# EasyEDA Pro project MFU.eprj, board MAIN_BOARD
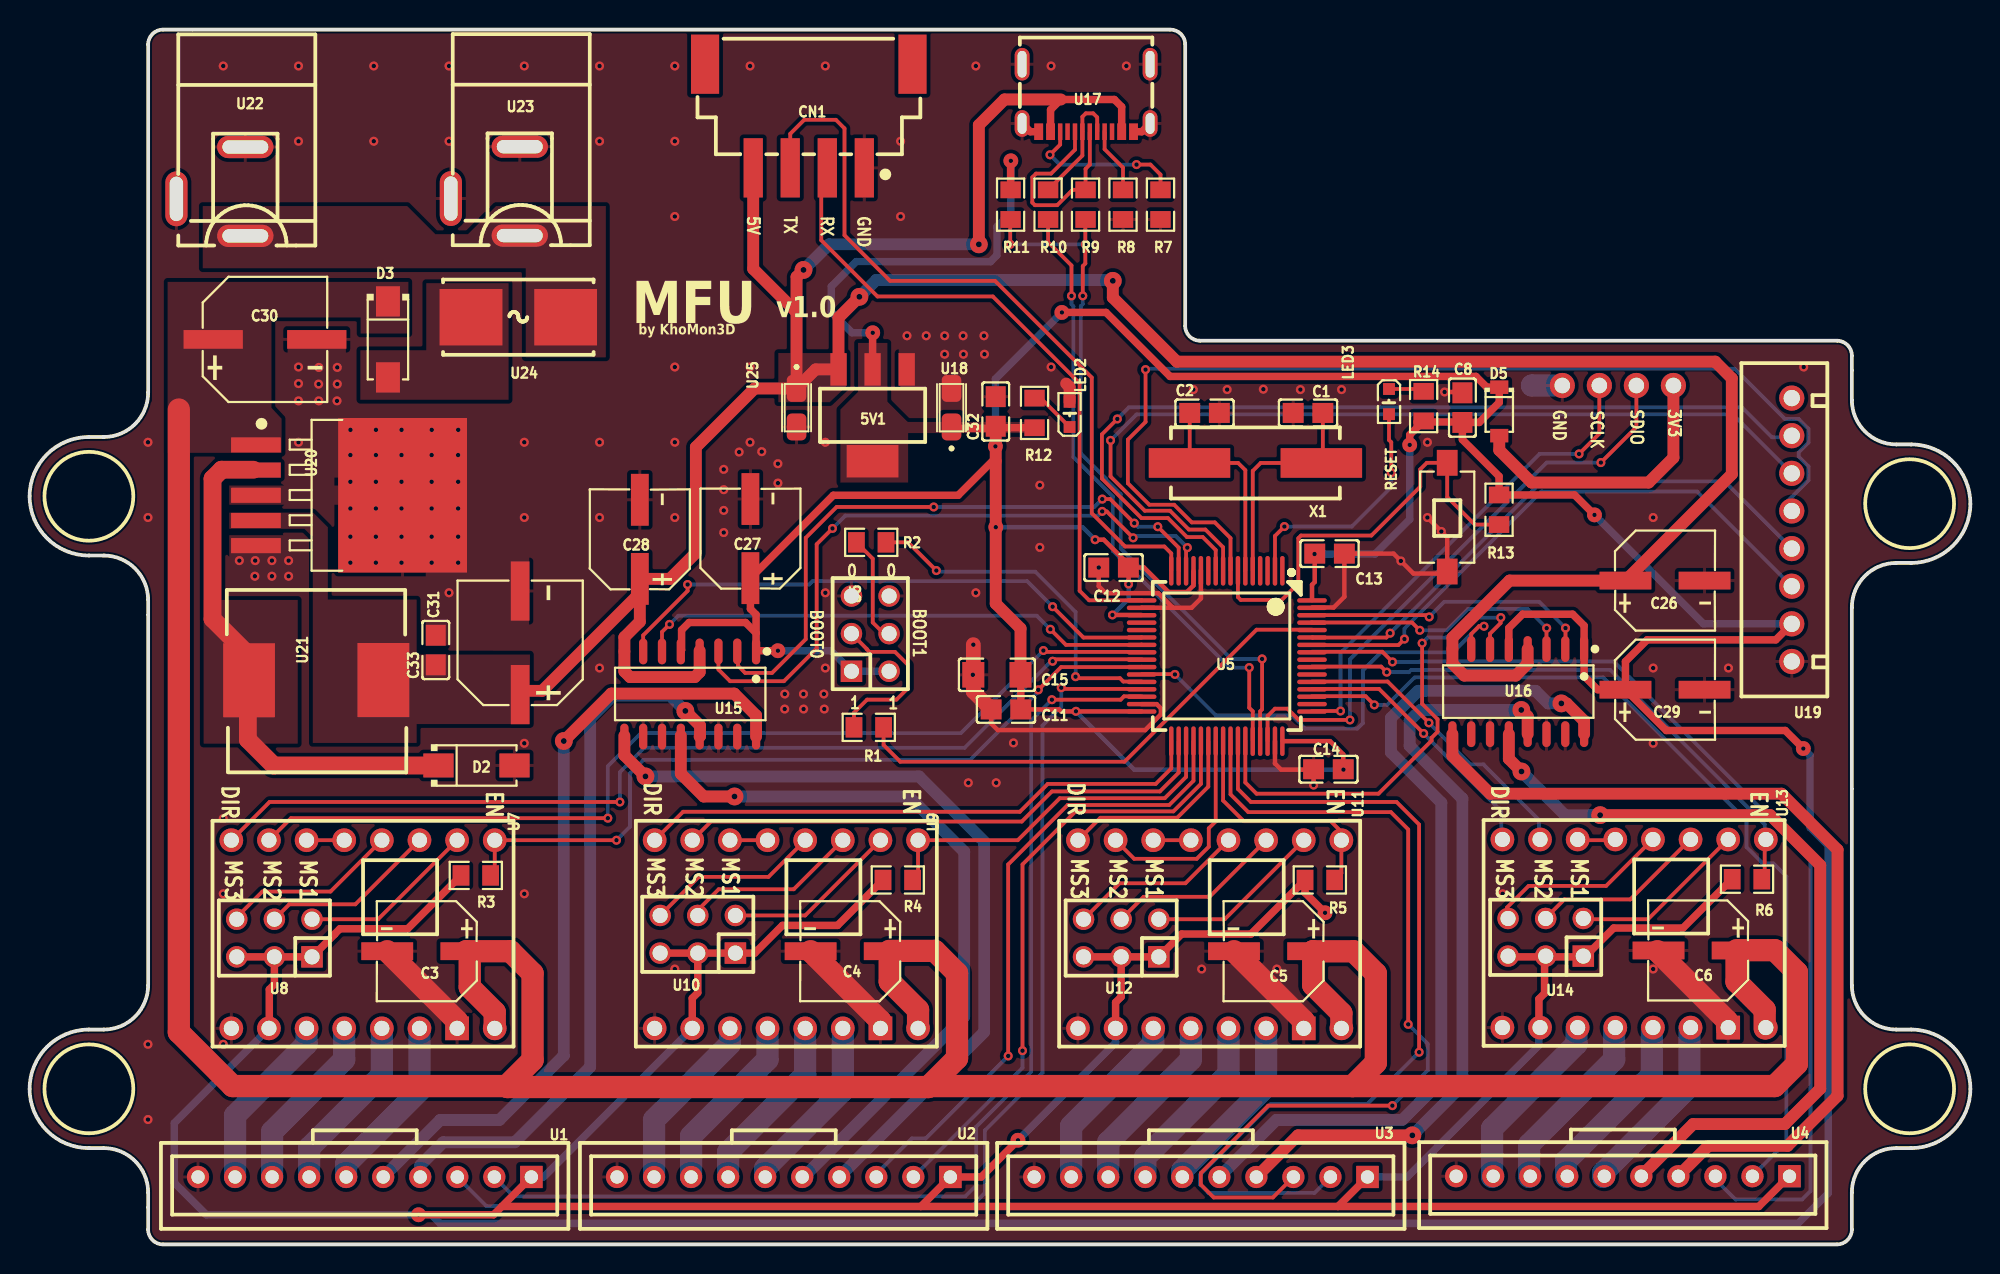
[diagram p3: board, top side]
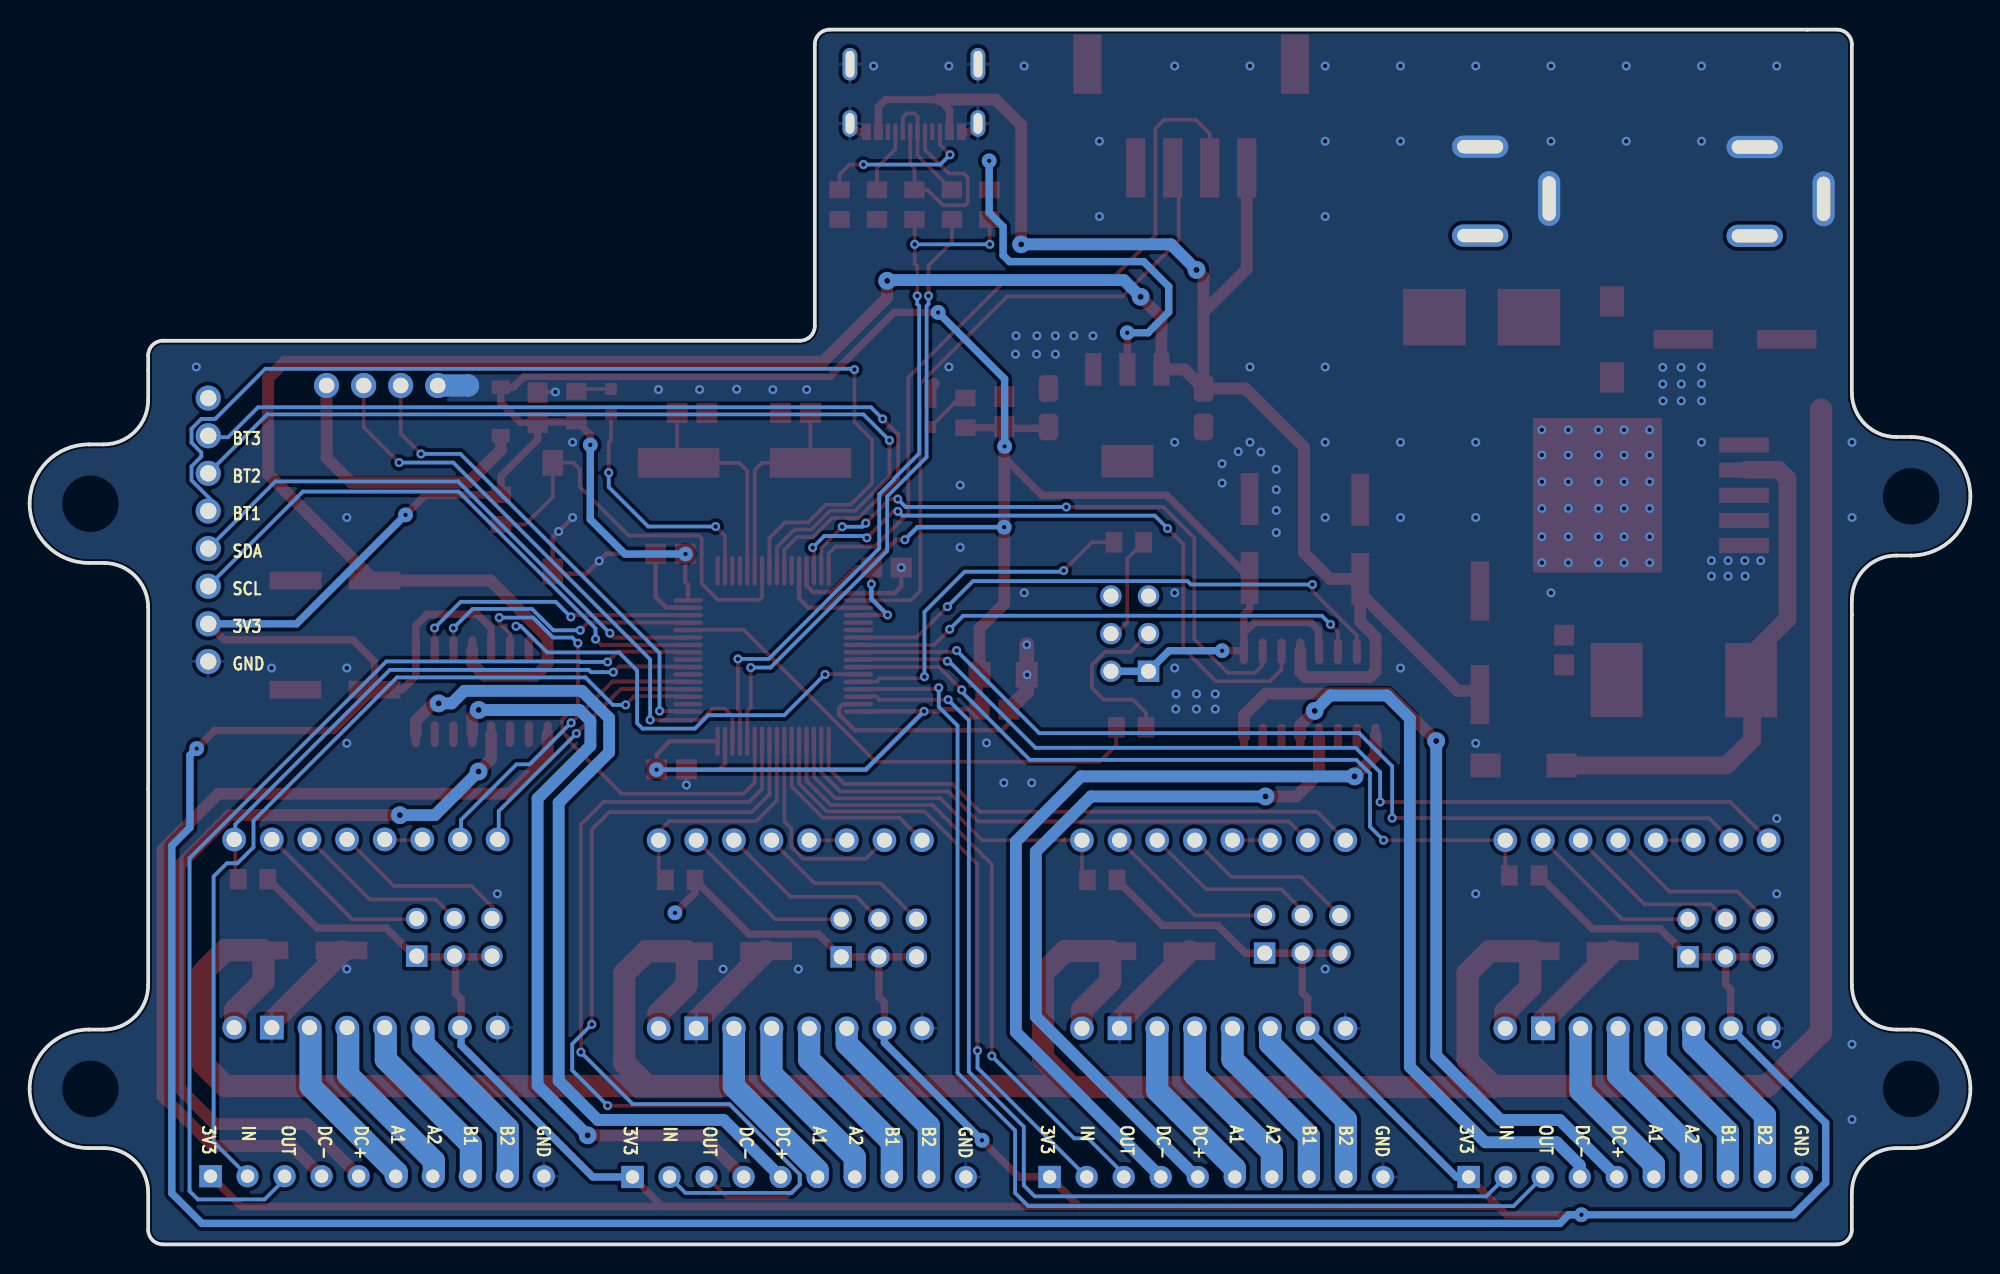
[diagram p4: board, bottom side, seen from below]

Outline 131 x 82 mm; copper layers: Top Layer, Bottom Layer. Coordinates in mm from the lower left corner of the outline.
Outline path: 0,50.5 arc(1.17,53.33) 4,54.5 5,54.5 arc(7.12,55.38) 8,57.5 8,81 arc(8.29,81.71) 9,82 77,82 arc(77.71,81.71) 78,81 78,62 arc(78.29,61.29) 79,61 122,61 arc(122.71,60.71) 123,60 123,57 arc(123.88,54.88) 126,54 127,54 arc(129.83,52.83) 131,50 arc(129.83,47.17) 127,46 126,46 arc(123.88,45.12) 123,43 123,17.5 arc(123.88,15.38) 126,14.5 127,14.5 arc(129.83,13.33) 131,10.5 arc(129.83,7.67) 127,6.5 126,6.5 arc(123.88,5.62) 123,3.5 123,1 arc(122.71,0.29) 122,0 9,0 arc(8.29,0.29) 8,1 8,3.5 arc(7.12,5.62) 5,6.5 4,6.5 arc(1.17,7.67) 0,10.5 arc(1.17,13.33) 4,14.5 5,14.5 arc(7.12,15.38) 8,17.5 8,43.5 arc(7.12,45.62) 5,46.5 4,46.5 arc(1.17,47.67) 0,50.5
Stack: Top Layer 0.035mm / Dielectric1 1.51mm FR4 er 4.5 / Bottom Layer 0.035mm

## Design rules (mm)
template: Custom Config
spacing copperThickness1oz (default): track to track 0.102, other pairs 0.152 to 0.3
spacing copperThickness2oz: track to track 0.203, other pairs 0.152 to 0.3
track width copperThickness1oz: min 0.127, default 0.254, max 2.54
track width copperThickness2oz: min 0.203, default 0.254, max 2.54
track width 12V: min 0.127, default 1.5, max 2.54
track width 5V: min 0.127, default 0.8, max 2.54
track width 3V3: min 0.127, default 0.5, max 2.54
track width 0.3 (default): min 0.127, default 0.254, max 2.54
track width 5v_usb: min 0.127, default 0.5, max 2.54
differential pair differentialPair (default): width min 0.127, default 0.254, max 2.54; gap min 0.152, default 0.152
via viaSize (default): diameter min 0.5, default 0.61, max 10; hole min 0.3, default 0.305, max 6.3
via 12v: diameter min 0.5, default 1.5, max 10; hole min 0.3, default 0.6, max 6.3
via 5v: diameter min 0.5, default 1.2, max 10; hole min 0.3, default 0.4, max 6.3
via 3v3: diameter min 0.5, default 1, max 10; hole min 0.3, default 0.3, max 6.3
net GND uses 12V
net A11 uses 12V
net DC1+ uses 5V, 5v
net DC1- uses 5V, 5v
net 3V3 uses 3V3, 3v3
net A21 uses 12V
net B11 uses 12V
net B21 uses 12V
net A12 uses 12V
net DC2+ uses 5V, 5v
net DC2- uses 5V, 5v
net A22 uses 12V
net B12 uses 12V
net B22 uses 12V
net A13 uses 12V
net DC3+ uses 5V, 5v
net DC3- uses 5V, 5v
net A23 uses 12V
net B13 uses 12V
net B23 uses 12V
net A14 uses 12V
net DC4+ uses 5V, 5v
net DC4- uses 5V, 5v
net A24 uses 12V
net B14 uses 12V
net B24 uses 12V
net 12V uses 12V, 12v
net 5V uses 5V, 5v
net $1N9497 uses 5V
net 12V_IN uses 12V, 12v

## Placement (name value [footprint] x y rotation side)
5V1  -  [SOT-223_L6.7-W3.5-P2.30-BR]  56.9 55.96 90 top
C1  22p  [C0805]  86.29 56.13 180 top
C2  22p  [C0805]  79.31 56.13 0 top
C3  100uF  [CAP-SMD_BD6.3-L6.6-W6.6-FD]  26.81 19.79 180 top
C4  100uF  [CAP-SMD_BD6.3-L6.6-W6.6-FD]  55.39 19.79 180 top
C5  100uF  [CAP-SMD_BD6.3-L6.6-W6.6-FD]  83.97 19.79 180 top
C6  100uF  [CAP-SMD_BD6.3-L6.6-W6.6-FD]  112.62 19.84 180 top
C8  0.1u  [C0805]  96.71 56.48 90 top
C11  0.1u  [C0805]  65.9 36.11 180 top
C12  0.1u  [C0805]  73.17 45.69 180 top
C13  0.1u  [C0805]  87.75 46.63 0 top
C14  0.1u  [C0805]  87.67 32.07 180 top
C15  1u  [C1206]  65.29 38.45 180 top
C26  100u  [CAP-SMD_BD6.3-L6.6-W6.6-FD]  110.39 44.81 0 top
C27  4.7u  [CAP-SMD_BD6.3-L6.6-W6.6-FD]  48.65 47.64 90 top
C28  100u  [CAP-SMD_BD6.3-L6.6-W6.6-FD]  41.19 47.59 90 top
C29  4.7u  [CAP-SMD_BD6.3-L6.6-W6.6-FD]  110.39 37.44 0 top
C30  220uF  [CAP-SMD_BD8.0-L8.3-W8.3-LS10.0-FD-1]  15.89 61.09 0 top
C31  220uF  [CAP-SMD_BD8.0-L8.3-W8.3-LS10.0-FD-1]  33.11 40.61 90 top
C32  0.1u  [C0805]  65.21 56.22 90 top
C33  0.1u  [C0805]  27.42 40.12 90 top
CN1  XH2.54-4P  [CONN-SMD_4P-P2.50-WT]  52.59 76.17 180 top
D2  SS34  [SMA_L4.4-W2.8-LS5.4-RD]  30.16 32.33 0 top
D3  SS54  [SMA_L4.4-W2.8-LS5.4-RD]  24.19 61.09 270 top
D5  BAT54GWJ-HXY  [SOD-123_L2.7-W1.6-LS3.7-RD]  99.2 56.23 270 top
LED2  -  [LED0603-R-RD]  70.2 56.03 90 top
LED3  -  [LED0603-R-RD]  91.76 56.89 270 top
P1  XH2.54-4P  [CONN-TH_4P-P2.50-XH2.54-4P]  107.21 57.98 180 top
R1  10k  [R0805]  56.64 34.9 180 top
R2  10k  [R0805]  56.81 47.39 0 top
R3  10k  [R0805]  30.12 24.9 0 top
R4  10k  [R0805]  58.6 24.6 0 top
R5  10k  [R0805]  87.09 24.6 0 top
R6  10k  [R0805]  115.92 24.65 0 top
R7  5.1k  [R0805]  76.33 70.18 270 top
R8  5.1k  [R0805]  73.8 70.18 270 top
R9  22  [R0805]  71.27 70.18 270 top
R10  22  [R0805]  68.75 70.18 270 top
R11  1.5k  [R0805]  66.22 70.18 270 top
R12  10k  [R0805]  67.83 56.13 270 top
R13  10k  [R0805]  99.19 49.59 90 top
R14  10k  [R0805]  94.1 56.58 270 top
RESET  key_3x6_2P  [SW-SMD_L6.0-W3.5-LS8.0]  95.69 49.09 270 top
U1  BX-HA2.54-10PZZ  [CONN-TH_10P-P2.50_BX-HA2.54-10PZZ]  22.62 4.55 180 top
U2  BX-HA2.54-10PZZ  [CONN-TH_10P-P2.50_BX-HA2.54-10PZZ]  50.9 4.55 180 top
U3  BX-HA2.54-10PZZ  [CONN-TH_10P-P2.50_BX-HA2.54-10PZZ]  79.06 4.55 180 top
U4  BX-HA2.54-10PZZ  [CONN-TH_10P-P2.50_BX-HA2.54-10PZZ]  107.54 4.6 180 top
U5  STM32F103RBT6  [LQFP-64_L10.0-W10.0-P0.50-LS12.0-BL]  80.81 39.72 180 top
U6  HX PZ2.54-3x2P ZZ  [HDR-TH_6P-P2.54-V-M-R3-C2-S2.54_2]  56.74 41.23 0 top
U7  TMC  [DIP-16_L20.3-W15.2-P2.54_LS12.7_A4988]  22.5 20.93 270 top
U8  HX PZ2.54-3x2P ZZ  [HDR-TH_6P-P2.54-V-M-R3-C2-S2.54_2]  16.52 20.68 90 top
U9  TMC  [DIP-16_L20.3-W15.2-P2.54_LS12.7_A4988]  51.08 20.93 270 top
U10  HX PZ2.54-3x2P ZZ  [HDR-TH_6P-P2.54-V-M-R3-C2-S2.54_2]  45.1 20.93 90 top
U11  TMC  [DIP-16_L20.3-W15.2-P2.54_LS12.7_A4988]  79.65 20.93 270 top
U12  HX PZ2.54-3x2P ZZ  [HDR-TH_6P-P2.54-V-M-R3-C2-S2.54_2]  73.68 20.68 90 top
U13  TMC  [DIP-16_L20.3-W15.2-P2.54_LS12.7_A4988]  108.3 20.98 270 top
U14  HX PZ2.54-3x2P ZZ  [HDR-TH_6P-P2.54-V-M-R3-C2-S2.54_2]  102.33 20.73 90 top
U15  MAX1508  [SOP-16_L10.0-W3.9-P1.27-LS6.0-BL]  44.59 37.15 180 top
U16  MAX1508  [SOP-16_L10.0-W3.9-P1.27-LS6.0-BL]  100.48 37.32 180 top
U17  UC.01.51-11-0017,typec  [TYPE-C-SMD_UC.01.51-11-0017]  71.31 77.39 180 top
U18  TAJA106M010RNJ  [CAPMP3216X180N]  62.23 56.48 90 top
U19  XH2.54-8  [CONN-TH_8P-P2.54_XH2.54_C9900012080]  118.94 48.24 270 top
U20  LM2596S-5.0  [TO-263-5_L10.1-W8.7-P1.70-LS14.4-BR]  20.22 50.57 180 top
U21  INDUCTOR/100uH-3A  [IND-SMD_L11.0-W10.2_CXP1050]  19.09 38.37 0 top
U22  POWER-JACK  [DC-IN-TH_POWER-JACK]  12.23 71.08 270 top
U23  POWER-JACK  [DC-IN-TH_POWER-JACK]  30.76 71.1 270 top
U24  1808 SMD Fuseholder  [FUSE-SMD_L9.7-W5.0]  32.99 62.59 180 top
U25  TAJA106M010RNJ  [CAPMP3216X180N]  51.77 56.48 270 top
X1  8MHz  [CRYSTAL-SMD_L11.5-W4.8-LS12.7]  82.74 52.75 0 top

## Footprints (pads in the part's own frame, mm; a bottom-side part is the same pattern mirrored in y, then rotated)
C0805
  rect 1.41x1.35 smd: 1(-1,0) 2(1,0)
C1206
  rect 1.485x1.728 smd: 1(-1.593,0) 2(1.593,0)
CAP-SMD_BD6.3-L6.6-W6.6-FD
  rect 3.5x1.2 smd: 1(-2.67,0) 2(2.67,0)
CAP-SMD_BD8.0-L8.3-W8.3-LS10.0-FD-1
  rect 4x1.26 smd: 1(-3.495,0) 2(3.495,0)
CAPMP3216X180N
  rrect 1.81x1.32 smd: 1(-1.3,0) 2(1.3,0)
CONN-SMD_4P-P2.50-WT
  rect 1.3x4 smd: 1(-3.75,3.5) 2(-1.25,3.5) 3(1.25,3.5) 4(3.751,3.5)
  rect 1.9x4 smd: 5(7,-3.5) 6(-7,-3.5)
CONN-TH_4P-P2.50-XH2.54-4P
  round 1.7 hole 1.05: 1(3.75,0) 2(1.25,0) 3(-1.25,0) 4(-3.75,0)
CONN-TH_8P-P2.54_XH2.54_C9900012080
  round 1.7 hole 1.1: 1(-8.89,0) 2(-6.35,0) 3(-3.81,0) 4(-1.27,0) 5(1.27,0) 6(3.81,0) 7(6.35,0) 8(8.89,0)
CONN-TH_10P-P2.50_BX-HA2.54-10PZZ
  rect 1.524x1.5 hole 0.9: 1(-11.25,0)
  round 1.5 hole 0.9: 2(-8.75,0) 3(-6.25,0) 4(-3.75,0) 5(-1.25,0) 6(1.25,0) 7(3.75,0) 8(6.25,0) 9(8.75,0) 10(11.25,0)
CRYSTAL-SMD_L11.5-W4.8-LS12.7
  rect 5.5x2 smd: 1(-4.45,0) 2(4.45,0)
DC-IN-TH_POWER-JACK
  oval 1.5x3.8 hole 0.9x3.1: 1(2.999,2.325) 2(-2.999,2.325)
  oval 3.7x1.5 hole 3x0.9: 3(0.5,-2.325)
DIP-16_L20.3-W15.2-P2.54_LS12.7_A4988
  round 1.6 hole 1.02: 1(-6.35,8.89) 2(-6.35,6.35) 3(-6.35,3.81) 4(-6.35,1.27) 5(-6.35,-1.27) 6(-6.35,-3.81) 7(-6.35,-6.35) 8(-6.35,-8.89) 9(6.35,-8.89) 10(6.35,-6.35) 11(6.35,-3.81) 12(6.35,-1.27) 13(6.35,1.27) 14(6.35,3.81) 16(6.35,8.89)
  rect 1.6x1.6 hole 1.02: 15(6.35,6.35)
FUSE-SMD_L9.7-W5.0
  rect 4.24x3.81 smd: 1(-3.192,0) 2(3.192,0)
HDR-TH_6P-P2.54-V-M-R3-C2-S2.54_2
  rect 1.45x1.45 hole 1.02: 1(-1.27,-2.54)
  round 1.45 hole 1.02: 2(-1.27,0) 3(-1.27,2.54) 4(1.27,-2.54) 5(1.27,0) 6(1.27,2.54)
IND-SMD_L11.0-W10.2_CXP1050
  custom 3.5x5 smd: 1(-4.28,-0.292) 2(4.788,-0.28)
LED0603-R-RD
  rect 0.8x0.8 smd: 1(0.851,0) 2(-0.851,0)
LQFP-64_L10.0-W10.0-P0.50-LS12.0-BL
  oval 0.3x2 smd: 1(-3.75,-5.75) 2(-3.25,-5.75) 3(-2.75,-5.75) 4(-2.25,-5.75) 5(-1.75,-5.75) 6(-1.25,-5.75) 7(-0.75,-5.75) 8(-0.25,-5.75) 9(0.25,-5.75) 10(0.75,-5.75) 11(1.25,-5.75) 12(1.75,-5.75) 13(2.25,-5.75) 14(2.75,-5.75) 15(3.25,-5.75) 16(3.75,-5.75) 33(3.75,5.75) 34(3.25,5.75) 35(2.75,5.75) 36(2.25,5.75) 37(1.75,5.75) 38(1.25,5.75) 39(0.75,5.75) 40(0.25,5.75) 41(-0.25,5.75) 42(-0.75,5.75) 43(-1.25,5.75) 44(-1.75,5.75) 45(-2.25,5.75) 46(-2.75,5.75) 47(-3.25,5.75) 48(-3.75,5.75)
  oval 2x0.3 smd: 17(5.75,-3.75) 18(5.75,-3.25) 19(5.75,-2.75) 20(5.75,-2.25) 21(5.75,-1.75) 22(5.75,-1.25) 23(5.75,-0.75) 24(5.75,-0.25) 25(5.75,0.25) 26(5.75,0.75) 27(5.75,1.25) 28(5.75,1.75) 29(5.75,2.25) 30(5.75,2.75) 31(5.75,3.25) 32(5.75,3.75) 49(-5.75,3.75) 50(-5.75,3.25) 51(-5.75,2.75) 52(-5.75,2.25) 53(-5.75,1.75) 54(-5.75,1.25) 55(-5.75,0.75) 56(-5.75,0.25) 57(-5.75,-0.25) 58(-5.75,-0.75) 59(-5.75,-1.25) 60(-5.75,-1.75) 61(-5.75,-2.25) 62(-5.75,-2.75) 63(-5.75,-3.25) 64(-5.75,-3.75)
R0805
  rect 1.133x1.377 smd: 1(-1,0) 2(1,0)
SMA_L4.4-W2.8-LS5.4-RD
  rect 2.046x1.62 smd: 1(-2.566,0) 2(2.566,0)
SOD-123_L2.7-W1.6-LS3.7-RD
  rect 0.91x1.22 smd: 1(-1.635,0) 2(1.635,0)
SOP-16_L10.0-W3.9-P1.27-LS6.0-BL
  oval 0.56x1.745 smd: 1(-4.445,-2.873) 2(-3.175,-2.873) 3(-1.905,-2.873) 4(-0.635,-2.873) 5(0.635,-2.873) 6(1.905,-2.873) 7(3.175,-2.873) 8(4.445,-2.873) 9(4.445,2.873) 10(3.175,2.873) 11(1.905,2.873) 12(0.635,2.873) 13(-0.635,2.873) 14(-1.905,2.873) 15(-3.175,2.873) 16(-4.445,2.873)
SOT-223_L6.7-W3.5-P2.30-BR
  rect 2.2x1.1 smd: 1(3.099,-2.3) 2(3.099,0) 3(3.099,2.3)
  rect 2.2x3.5 smd: 4(-3.099,0)
SW-SMD_L6.0-W3.5-LS8.0
  rect 1.74x1.4 smd: 1(-3.67,0) 2(3.67,0)
TO-263-5_L10.1-W8.7-P1.70-LS14.4-BR
  rect 3.358x1.02 smd: 1(4.949,-3.4) 2(4.949,-1.7) 3(4.949,0) 4(4.949,1.7) 5(4.949,3.4)
  rect 8.7x10.431 smd: 6(-4.949,0)
TYPE-C-SMD_UC.01.51-11-0017
  rect 0.6x1.12 smd: A1B12(-3.2,2.277) A4B9(-2.4,2.277) B1A12(3.2,2.277) B4A9(2.4,2.277)
  rect 0.3x1.12 smd: A5(-1.25,2.277) A6(-0.25,2.277) A7(0.25,2.277) A8(1.25,2.277) B5(1.75,2.277) B6(0.75,2.277) B7(-0.75,2.277) B8(-1.75,2.277)
  oval 1x1.8 hole 0.6x1.4: EH1(-4.32,1.722) EH1(4.32,1.722)
  oval 1x2.2 hole 0.6x1.8: EH1(-4.32,-2.277) EH1(4.32,-2.277)

## Nets
As in the schematic, except:
GND: 5V1.1 C1.2 C2.2 C3.2 C4.2 C5.2 C6.2 C8.2 C11.2 C12.2 C13.2 C14.2 C15.2 C26.2 C27.2 C28.2 C29.2 C30.2 C31.2 C32.2 C33.2 CN1.1 D2.2 LED2.1 P1.1 R7.2 R8.2 RESET.2 U1.10 U2.10 U3.10 U4.10 U5.12 U5.18 U5.31 U5.47 U5.63 U6.3 U6.6 U7.9 U7.15 U9.9 U9.15 U11.9 U11.15 U13.9 U13.15 U15.10 U15.11 U15.14 U15.15 U16.10 U16.11 U16.14 U16.15 U17.A1B12 U17.B1A12 U17.EH1 U18.2 U19.8 U20.3 U20.5 U20.6 U22.2 U22.3 U23.2 U23.3 U25.2
RESET: R13.1 RESET.1 U5.7

Pads without a net: CN1 5 6; U5 1 3 4 11 20 21 50 54 56; U17 A8 B8; U19 1

## Via types
v1: diameter 0.61, hole 0.305, Top Layer to Bottom Layer, 202 vias
v2: diameter 1.2, hole 0.4, Top Layer to Bottom Layer, 13 vias
v3: diameter 0.6, hole 0.3, Top Layer to Bottom Layer, 2 vias
v4: diameter 1, hole 0.3, Top Layer to Bottom Layer, 14 vias
v5: diameter 0.61, hole 0.3, Top Layer to Bottom Layer, 2 vias

## Routing (per net, layer and track width the routed paths; a pad name or vN(x,y) marks a point on that pad's centre or on a via; arc(x,y) is an arc through that point)
3V3: length 687.5
  Top Layer w0.3: 75.05,35.98 69.62,35.98 69.48,36.11 C11.1 ; C13.1 86.75,44.71 86.56,44.53 86.56,43.49 ; v5(71.92,47.57) 72.51,47.57 74.17,45.91 C12.1 ; C12.1 74.18,45.67 v3(74.18,44.57) ; C12.1 75.22,45.69 76.87,44.04 78.12,44.04 78.56,44.48 U5.13 ; C14.1 88.67,33.08 87.78,33.97 U5.48 ; 75.05,42.49 v3(73.09,42.49)
  Top Layer w0.5: C14.1 88.67,32.06 v4(88.69,32.05) ; U10.2 U10.3 ; U10.2 U10.1 48.94,19.66 50.81,21.53 54.54,21.53 R4.1 ; U10.2 45.1,16.99 44.73,16.62 U9.10 ; U12.2 U12.1 77.76,20.95 82.44,20.95 R5.1 86.09,23.73 v4(87.44,22.38) ; U12.2 73.68,16.71 73.3,16.34 U11.10 ; U12.2 U12.3 ; C29.1 107.72,39.35 109.18,40.81 117.87,40.81 U19.7 ; C29.1 110.47,34.69 118.5,34.69 v4(119.72,33.47) ; C29.1 105.85,37.44 104.93,38.36 U16.1 104.93,41.76 104.15,42.54 100.78,42.54 99.85,41.61 U16.5 ; R14.2 94.03,55.51 ; 94.03,55.51 93.16,54.64 v4(93.16,53.97) ; 94.03,55.51 93.64,55.51 ; v4(26.25,2) 31.32,2 31.88,2.56 ; U8.2 U8.3 ; U8.2 U8.1 20.59,20.94 20.59,20.95 20.94,21.3 25.52,21.3 R3.1 ; U8.2 16.52,17.55 16.18,17.21 16.18,14.61 U7.10 ; 102.26,19.41 104.98,19.41 106.92,21.35 111.6,21.35 114.85,24.6 ; 102.26,19.41 99.72,19.41 ; 102.26,19.41 102.26,16.94 101.88,16.56 101.88,14.58 ; R12.2 65.17,55.13 65.13,55.09 62.32,55.09 U18.1 ; 31.88,2.56 U1.1 ; 31.88,2.56 60.16,2.56 ; C8.1 97.84,55.48 99.2,56.84 D5.1 98.35,57.86 97.63,58.59 76.98,58.59 72.66,62.91 v4(69.68,62.91) ; C8.1 96.71,54.32 99.19,51.85 R13.2 104.28,50.59 v4(105.63,49.24) ; C8.1 96.33,55.48 96.3,55.51 94.1,55.51 ; v4(56.91,61.54) 56.9,61.53 5V1.2 ; C15.1 66.9,38.43 C11.1 ; U3.1 88.31,2.56 ; 88.31,2.56 116.72,2.56 118.71,4.55 ; 88.31,2.56 60.16,2.56 ; 43.96,40.08 44.01,40.13 44.01,41.47 44.51,41.98 48.32,41.98 49.04,41.27 ; v4(50.51,40.07) 49.08,40.07 U15.1 ; 49.04,41.27 49.04,42.51 48.65,42.89 C27.1 54.25,50.56 62.68,50.56 65.09,52.98 65.21,52.86 ; 49.04,41.27 49.04,40.08 ; R11.1 66.22,73.13 v4(66.23,73.15) ; 60.16,2.56 U2.1 64.23,4.55 v4(66.71,7.03)
  Top Layer w0.8: C32.1 65.21,43.25 66.88,41.58 C15.1
  Bottom Layer w0.3: v5(70.63,35.98) 74.56,32.05 v4(88.69,32.05) ; v5(71.92,47.57) 71.07,48.41 v4(65.22,48.41) ; v3(73.09,42.49) 74.18,43.58 v3(74.18,44.57)
  Bottom Layer w0.5: 101.88,14.58 101.88,13.44 92.99,4.55 U3.1 ; U9.10 34.7,4.55 U1.1 ; v4(119.72,33.47) 120.18,33.01 120.18,28.14 121.4,26.92 121.4,3.45 119.37,1.42 27.7,1.42 27.12,2 v4(26.25,2) 11.93,2 9.77,4.16 9.77,8.2 U7.10 ; v4(93.16,53.97) 93.16,48.94 90.82,46.6 v4(86.73,46.6) ; v4(69.68,62.91) 65.19,58.42 v4(65.19,53.87) ; U11.10 73.3,13.62 v4(66.71,7.03) ; U6.4 U6.1 54.09,40.07 v4(50.51,40.07) ; v4(56.91,61.54) 55.51,61.54 54.12,62.93 54.12,64.66 55.79,66.34 64.86,66.34 65.29,66.77 65.29,68.7 66.23,69.64 v4(66.23,73.15) ; U19.7 112.98,41.89 v4(105.63,49.24)
5V: length 209
  Top Layer w0.5: U17.A4B9 73.71,76.79 73.22,77.29 69.61,77.29 68.91,76.59 U17.B4A9
  Top Layer w0.8: 51.77,62.92 U25.1 ; 51.77,62.92 51.77,65.31 v2(52.24,65.78) ; 51.77,62.92 48.84,65.85 48.84,72.67 ; U25.1 53.05,59.06 5V1.3 54.6,62.56 v2(56.01,63.96) ; U25.1 48.93,57.78 44.97,53.82 44.97,46.68 43.22,44.92 C28.1 41.19,43.96 ; 45.23,40.08 45.23,38.63 44.9,38.3 40.53,38.3 40.15,38.68 U15.8 40.15,40.99 41.19,42.03 41.19,43.96 ; 41.19,43.96 34.6,37.37 33.29,37.37 33.08,37.16 ; v2(73.12,65.04) 73.12,63.91 77.44,59.59 113.77,59.59 114.9,58.46 114.9,51.99 C26.1 99.9,44.81 96.04,40.95 U16.8 96.04,39.2 96.84,38.4 100.32,38.4 101.12,39.2 101.12,40.19 ; v2(64.07,67.51) 64.07,75.56 65.8,77.29 69.61,77.29
  Bottom Layer w0.8: v2(64.07,67.51) 53.96,67.51 v2(52.24,65.78) ; v2(56.01,63.96) 57.14,65.09 73.06,65.09 v2(73.12,65.04)
12V: length 228.4
  Top Layer w1.5: 10.07,56.36 10.07,14.32 13.7,10.69 32.2,10.69 ; 32.2,10.69 32.26,10.62 60.66,10.62 60.72,10.69 ; 32.2,10.69 33.95,12.44 33.95,18.29 32.45,19.79 C3.1 29.71,19.56 29.71,17.37 31.39,15.68 U7.16 ; 58.03,19.81 61.1,19.81 62.6,18.31 62.6,12.56 60.72,10.69 ; C5.1 86.64,19.78 ; 86.64,19.78 89.37,19.78 90.87,18.28 90.87,12.26 89.3,10.69 ; 86.64,19.78 86.64,17.51 88.54,15.6 U11.16 ; 117.12,14.58 117.12,15.83 115.21,17.74 115.21,19.79 ; 89.3,10.69 60.72,10.69 ; 89.3,10.69 117.79,10.69 119.29,12.19 119.29,18.36 117.79,19.86 115.23,19.86 ; U9.16 59.97,15.83 58.06,17.74 C4.1
GND: length 91.2
  Top Layer w0.3: 86.56,42.99 88.02,42.99 88.75,43.72 C13.2 92.06,46.63 v1(92.56,46.13) 93.41,45.28 95.55,45.28 RESET.2 95.69,47.73 v1(95.29,48.13) v1(94.35,49.07) ; 77.12,42.99 77.15,42.97 78.42,42.97 79.06,43.61 79.06,45.49 ; 77.12,42.99 77.12,43.03 76.19,43.96 72.63,43.96 72.17,44.43 v1(72.17,45.69) ; 77.12,42.99 77.1,42.97 75.07,42.97 75.06,42.97 ; 75.06,36.47 76.08,36.47 76.36,36.18 76.36,35.78 75.3,34.71 65.35,34.71 64.9,35.16 C11.2 ; C8.2 96.66,57.54 v1(95.51,57.54) ; v1(86.67,31.01) C14.2 86.64,32.05 84.47,32.05 84.06,32.46 U5.47
  Top Layer w0.5: U17.EH1 75.08,75.11 U17.A1B12 ; U17.B1A12 67.55,75.11 U17.EH1
  Top Layer w0.8: 70.2,56.88 70.2,57.88 69.97,58.11
  Top Layer w1: v1(63.7,40.48) C15.2 63.7,37.32 C11.2
  Top Layer w1.5: C3.2 28.85,15.07 U7.15 ; 114.58,14.58 114.58,15.09 109.87,19.79 ; C5.2 86,15.08 U11.15 ; C4.2 57.43,15.08 U9.15
  Bottom Layer w1.5: 101.41,57.98 101.41,57.98 P1.1
  vias: v1(7.99,54.15) v1(7.99,49.07) v1(7.99,13.51) v1(7.99,8.43) v1(13.07,79.55) v1(13.07,28.75) v1(13.07,23.67) v1(13.07,13.51) v1(14.16,46.16) v1(15.22,46.16) v1(15.2,45.1) v1(16.35,46.16) v1(16.35,45.1) v1(17.48,46.16) v1(17.48,45.1) v1(18.15,79.55) v1(18.15,74.47) v1(18.15,59.23) v1(18.15,58.11) v1(18.15,56.94) v1(18.15,54.15) v1(19.53,59.2) v1(19.51,58.07) v1(19.52,56.94) v1(20.77,59.2) v1(20.77,58.07) v1(20.75,56.94) v1(21.65,54.98) v1(21.65,53.28) v1(21.65,51.48) v1(21.65,49.68) v1(21.65,47.77) v1(21.65,46.02) v1(23.23,79.55) v1(23.23,74.47) v1(23.38,54.98) v1(23.37,53.28) v1(23.37,51.48) v1(23.37,49.68) v1(23.37,47.77) v1(23.37,46.02) v1(25.11,54.98) v1(25.1,53.28) v1(25.1,51.48) v1(25.1,49.68) v1(25.1,47.77) v1(25.1,46.02) v1(27.14,54.98) v1(27.14,53.28) v1(27.14,51.48) v1(27.14,49.68) v1(27.14,47.77) v1(27.14,46.02) v1(28.31,79.55) v1(28.31,74.47) v1(28.31,43.99) v1(28.93,54.98) v1(28.92,53.28) v1(28.92,51.48) v1(28.92,49.68) v1(28.92,47.77) v1(28.92,46.02) v1(33.39,79.55) v1(33.39,54.15) v1(33.39,49.07) v1(33.39,33.83) v1(33.39,23.67) v1(38.47,79.55) v1(38.47,74.47) v1(38.47,54.15) v1(38.47,49.07) v1(38.47,38.91) v1(43.55,79.55) v1(43.55,74.47) v1(43.55,69.39) v1(43.55,59.23) v1(43.55,54.15) v1(43.55,49.07) v1(43.55,18.59) v1(46.85,52.32) v1(46.85,50.94) v1(46.85,49.54) v1(46.85,48.05) v1(47.89,53.49) v1(48.63,79.55) v1(48.63,59.23) v1(48.63,54.15) v1(49.42,53.51) v1(50.51,52.7) v1(50.51,51.39) v1(50.97,37.15) v1(50.97,36.14) v1(52.23,37.15) v1(52.24,36.14) v1(53.61,37.15) v1(53.71,79.55) v1(53.71,54.15) v1(53.71,43.99) v1(53.71,38.91) v1(53.64,36.14) v1(58.79,74.47) v1(58.79,69.39) v1(59.22,61.33) v1(60.52,61.33) v1(61.76,61.33) v1(61.76,60.09) v1(63.01,61.33) v1(63.03,60.09) v1(63.36,31.16) v1(63.67,38.45) v1(63.87,79.55) v1(63.87,43.99) v1(64.42,61.33) v1(64.45,60.09) v1(65.24,31.16) v1(66.41,33.85) v1(68.19,51.25) v1(68.19,47.05) v1(68.95,79.55) v1(68.95,59.23) v1(74.03,79.55) v1(78.55,57.7) v1(79.11,18.59) v1(80.83,57.7) v1(83.28,57.73) v1(84.19,18.59) v1(85.78,57.7) v1(88.56,57.7) v1(94.35,54.15) v1(99.43,23.67) v1(109.59,49.07) v1(109.59,38.91) v1(109.59,33.83) v1(109.59,18.59) v1(114.67,38.91) v1(119.75,59.23)
A11: length 12.1
  Bottom Layer w1.5: U7.14 26.31,10.37 21.37,5.42 U1.6
A12: length 12.2
  Bottom Layer w1.5: U9.14 54.89,10.37 49.65,5.13 U2.6
A13: length 12.4
  Bottom Layer w1.5: U3.6 77.81,5 83.46,10.66 U11.14
A14: length 12.4
  Bottom Layer w1.5: 106.21,4.55 106.21,4.85 112.04,10.67 112.04,14.58
A21: length 12.1
  Bottom Layer w1.5: U7.13 23.77,11.42 18.87,6.52 U1.7
A22: length 12.2
  Bottom Layer w1.5: U9.13 52.35,11.42 47.15,6.23 U2.7
A23: length 12.4
  Bottom Layer w1.5: U3.7 75.31,5.89 80.92,11.51 U11.13
A24: length 12.4
  Bottom Layer w1.5: 109.5,14.58 109.5,11.42 103.71,5.64 103.71,4.55
B11: length 12
  Bottom Layer w1.5: U1.8 16.37,7.61 21.23,12.48 U7.12
B12: length 12.2
  Bottom Layer w1.5: U2.8 44.65,7.32 49.81,12.48 U9.12
B13: length 12.3
  Bottom Layer w1.5: U3.8 72.81,6.9 78.38,12.48 U11.12
B14: length 12.4
  Bottom Layer w1.5: 101.21,4.55 101.21,6.73 106.96,12.48 106.96,14.58
B21: length 12
  Bottom Layer w1.5: U7.11 18.69,13.53 13.87,8.7 U1.9
B22: length 12.2
  Bottom Layer w1.5: U9.11 47.27,13.53 42.15,8.41 U2.9
B23: length 12.3
  Bottom Layer w1.5: U11.11 75.84,13.53 70.31,7.99 U3.9
B24: length 12.4
  Bottom Layer w1.5: 104.42,14.58 104.42,13.53 98.71,7.83 98.71,4.55
BOOT0: length 34.3
  Top Layer w0.254: R1.1 57.64,33.71 58.77,32.58 73.9,32.58 82.81,41.49 86.56,41.49
BOOT1: length 23.7
  Top Layer w0.254: R2.2 59.3,47.39 v1(61.2,45.48) ; v1(70.6,38.32) 70.7,38.22 73.6,38.22 73.82,37.99 75.06,37.99
  Bottom Layer w0.254: v1(61.2,45.48) 61.28,45.41 67.88,45.41 70.6,42.69 v1(70.6,38.32)
BT_DOWN: length 62.2
  Top Layer w0.254: v1(73.42,55.72) 72.38,54.68 72.38,51.7 75.05,49.03 76.84,49.03 78.12,47.75 79.19,47.75 80.06,46.87 80.06,45.49
  Bottom Layer w0.254: U19.2 118.84,54.49 117.61,54.49 115.58,56.51 74.21,56.51 v1(73.42,55.72)
BT_ENTER: length 61.9
  Top Layer w0.254: 80.56,45.49 80.56,47.06 79.36,48.25 78.25,48.25 76.98,49.52 75.27,49.52 72.96,51.83 v1(72.96,54.27)
  Bottom Layer w0.254: U19.3 114.97,56.03 74.71,56.03 v1(72.96,54.27)
BT_UP: length 72.2
  Top Layer w0.254: 81.06,45.49 81.06,47.67 80,48.74 78.45,48.74 77.25,49.93 75.58,49.93 74.13,51.38 74.13,54.32 75.32,55.52 v1(75.32,59.05)
  Bottom Layer w0.254: v1(75.32,59.05) 75.38,59.11 115.09,59.11 118.48,55.72 119.41,55.72 120.07,55.06 120.07,54.12 119.41,53.46 119.41,53.18 120.07,52.52 120.07,51.58 118.51,50.02 118.51,49.94 U19.4
D+: length 48.4
  Top Layer w0.254: R11.2 66.19,69.16 v1(66.19,67.51) ; v1(71.09,64.03) 71.09,66.04 71.26,66.21 v1(71.26,67.51) 71.26,69.17 R9.2 ; 83.06,33.99 83.06,35.98 83.19,36.12 v1(83.19,39.52)
  Bottom Layer w0.254: v1(83.19,39.52) 81.11,39.52 73.65,46.98 73.65,50.64 72.66,51.63 72.66,51.68 70.96,53.38 70.96,63.34 71.09,63.47 v1(71.09,64.03) ; v1(66.19,67.51) v1(71.26,67.51)
D-: length 41.7
  Top Layer w0.254: R10.2 68.75,67.66 70.32,66.08 v1(70.32,64.03) ; 82.56,33.99 82.56,35.98 82.32,36.22 v1(82.32,38.94)
  Bottom Layer w0.254: v1(82.32,38.94) 80.99,38.94 73.12,46.81 73.12,50.49 70.46,53.15 70.46,63.34 70.32,63.47 v1(70.32,64.03)
DC1+: length 53.2
  Top Layer w0.8: U15.16 49.04,35.71 47.56,37.18 39.26,37.18 v2(36.06,33.98)
  Bottom Layer w0.8: U1.5 27.72,8.4 31.71,8.4 36.06,12.74 v2(36.06,33.98)
DC1-: length 48.2
  Top Layer w0.8: v2(44.26,36.01) 45.25,35.02 45.25,34.31 U15.13
  Bottom Layer w0.8: v2(44.26,36.01) 43.22,37.05 39.38,37.05 37.83,35.5 37.83,11.98 32.75,6.89 27.92,6.89 26.37,5.34 U1.4
DC2+: length 50.4
  Top Layer w0.8: v2(47.58,30.23) 45.5,30.23 43.96,31.78 43.96,34.33
  Bottom Layer w0.8: U2.5 52.25,4.55 63.08,15.38 63.08,26.51 59.36,30.23 v2(47.58,30.23)
DC2-: length 54.7
  Top Layer w0.8: v2(41.57,31.59) 40.15,33.01 40.15,34.33
  Bottom Layer w0.8: U2.4 64.43,14.33 64.43,27.2 60.03,31.59 v2(41.57,31.59)
DC3+: length 59.1
  Top Layer w0.8: U16.16 104.93,35.34 103.75,36.52 v2(103.39,36.52)
  Bottom Layer w0.8: U3.5 84.16,8.4 92.65,8.4 95.29,11.04 95.29,29.81 91.89,33.22 91.89,35.53 93.72,37.37 101.66,37.37 102.5,36.52 v2(103.39,36.52)
DC3-: length 52.2
  Top Layer w0.8: v2(93.33,7.36) 85.61,7.36 U3.4 ; v2(100.69,36.07) 101.12,35.64 101.12,34.44
  Bottom Layer w0.8: v2(100.69,36.07) 93.88,36.07 93.15,35.34 93.15,33.66 96.71,30.09 96.71,10.74 v2(93.33,7.36)
DC4+: length 55.4
  Top Layer w0.8: v2(106.01,28.97) 117.49,28.97 120.87,25.6 120.87,10.51 118.48,8.12 112.29,8.12 108.71,4.55 ; v2(100.7,31.92) 99.85,32.77 U16.12
  Bottom Layer w0.8: v2(106.01,28.97) 103.65,28.97 v2(100.7,31.92)
DC4-: length 59.8
  Top Layer w0.8: 111.21,4.55 113.31,6.65 118.66,6.65 122.04,10.03 122.04,26.64 118.25,30.42 98.59,30.42 96.04,32.98 U16.9
DIR1: length 67.7
  Top Layer w0.254: 75.06,39.49 69.18,39.49 v1(69.05,39.36) ; v1(39.84,29.86) 16.2,29.86 U7.8
  Bottom Layer w0.254: v1(39.84,29.86) 39.84,31.87 41.49,33.52 63.11,33.52 68.95,39.36 v1(69.05,39.36)
DIR2: length 38.7
  Top Layer w0.254: U9.8 44.11,29.2 66.84,29.2 68.72,31.08 76.01,31.08 77.06,32.13 77.06,33.99
DIR3: length 13.4
  Top Layer w0.254: U11.8 72.28,28.8 77.46,28.8 79.56,30.9 79.56,33.99
DIR4: length 18.2
  Top Layer w0.254: 86.56,37.49 91.09,37.49 v1(94.1,34.49)
  Bottom Layer w0.254: v1(94.1,34.49) 99.34,29.25 99.34,27.28
EN1: length 53.2
  Top Layer w0.254: v1(68.09,37.43) 69.62,38.97 75.04,38.97 75.06,38.99 ; R3.2 31.39,25.18 U7.1 v1(39.61,27.28)
  Bottom Layer w0.254: v1(68.09,37.43) 68.09,37.31 63.49,32.71 41.44,32.71 40.53,31.79 40.53,28.2 v1(39.61,27.28)
EN2: length 25.1
  Top Layer w0.254: R4.2 59.97,24.97 U9.1 66.7,27.28 69.53,30.12 76.62,30.12 78.06,31.56 78.06,33.99
EN3: length 16.3
  Top Layer w0.254: 80.56,33.99 80.56,29.96 81.95,28.57 87.82,28.57 88.54,27.85 U11.1 88.54,25.05 R5.2
EN4: length 39
  Top Layer w0.254: 86.55,39 91.23,39 v1(91.61,38.63) ; 117.12,27.28 117.12,24.87 116.85,24.6
  Bottom Layer w0.254: 117.12,27.28 117.12,28.35 106.69,38.78 93.26,38.78 93.1,38.63 v1(91.61,38.63)
INA1: length 42.8
  Top Layer w0.254: v1(72.4,50.31) 72.94,50.31 v1(74.56,48.68) ; v1(76.15,48.44) 77.56,47.03 77.56,45.49 ; v1(61.02,49.78) 54.47,49.78 52.39,47.69 52.39,40.85 50.11,38.58 48.3,38.58 47.82,39.06 47.82,40.03 47.77,40.08
  Bottom Layer w0.254: v1(72.4,50.31) 71.87,49.78 v1(61.02,49.78) ; v1(76.15,48.44) 74.8,48.44 v1(74.56,48.68)
INA2: length 34.9
  Top Layer w0.254: 75.06,40.49 75.04,40.47 69.95,40.47 v1(68.9,41.52) ; 42.69,40.08 42.69,41.34 v1(43.19,41.85)
  Bottom Layer w0.254: v1(43.19,41.85) 43.78,42.44 67.98,42.44 v1(68.9,41.52)
INA3: length 19.8
  Top Layer w0.254: v1(94.47,42.35) 94.35,42.48 86.55,42.48 ; U16.2 103.67,40.2 v1(103.67,41.6)
  Bottom Layer w0.254: v1(94.47,42.35) 95.49,43.38 101.9,43.38 v1(103.67,41.6)
INA4: length 32.8
  Top Layer w0.254: v1(99.3,42.31) 99.29,42.3 99.29,41.94 98.58,41.23 U16.6 ; v1(93.99,40.58) 93.99,36.49 95.03,35.45 95.03,34.6 94.63,34.19 94.63,34 91.05,30.42 82.82,30.42 82.06,31.18 82.06,33.99
  Bottom Layer w0.254: v1(93.99,40.58) 94.38,40.96 95.67,40.96 97.01,42.31 v1(99.3,42.31)
INB1: length 44.8
  Top Layer w0.254: 78.06,45.49 78.06,46.95 v1(78.14,47.03) ; v1(54.19,48.33) 53.12,47.26 53.12,40.23 50.91,38.02 47.28,38.02 46.5,38.8 U15.3 ; v1(74.49,47.69) 72.7,49.48 v1(72.4,49.48)
  Bottom Layer w0.254: v1(54.19,48.33) 55.06,49.19 72.11,49.19 v1(72.4,49.48) ; v1(78.14,47.03) 77.36,47.82 74.61,47.82 v1(74.49,47.69)
INB2: length 38
  Top Layer w0.254: v1(44.41,44.54) 44.41,44.11 41.42,41.12 41.42,40.08 ; 75.06,40.99 75.03,40.96 71.13,40.96 v1(69.05,43.05)
  Bottom Layer w0.254: v1(44.41,44.54) 52.62,44.54 52.84,44.77 67.33,44.77 v1(69.05,43.05)
INB3: length 18.6
  Top Layer w0.254: v1(93.84,41.45) 93.31,41.98 86.57,41.98 86.55,42 ; U16.3 102.39,41.58 v1(102.4,41.6)
  Bottom Layer w0.254: v1(93.84,41.45) 95.65,41.45 97.09,42.89 101.11,42.89 v1(102.4,41.6)
INB4: length 31.7
  Top Layer w0.254: v1(98.17,41.73) 97.83,41.73 97.31,41.2 U16.7 ; 75.06,38.49 77.29,38.49 v1(77.31,38.47)
  Bottom Layer w0.254: v1(98.17,41.73) 98.16,41.74 97.84,41.74 96.06,39.96 91.21,39.96 89.99,38.74 89.99,35.18 89.62,34.82 86.09,34.82 85.19,35.72 80.06,35.72 v1(77.31,38.47)
LED: length 16.5
  Top Layer w0.254: v1(84.7,48.46) 84.06,47.82 84.06,45.49 ; v1(91.91,52.09) 91.91,54.15 91.76,54.3 LED3.1
  Bottom Layer w0.254: v1(91.91,52.09) 91.91,51.12 89.24,48.46 v1(84.7,48.46)
RESET: length 28.9
  Top Layer w0.254: U5.7 81.56,43.69 81.75,43.5 84.52,43.5 85.64,44.62 85.64,47.67 85.82,47.85 90.57,47.85 93.87,51.15 93.87,52.32 94.31,52.76 RESET.1 95.69,50.45 97.54,48.59 R13.1
RX: length 45
  Top Layer w0.254: 75.06,43.49 75.04,43.48 71.51,43.48 70.88,44.12 70.88,58.13 65.01,63.99 57.23,63.99 53.44,67.78 53.44,72.26 CN1.2
SCL: length 39.7
  Top Layer w0.254: v1(92.8,40.86) 92.39,40.46 86.6,40.46 86.58,40.47 U5.58
  Bottom Layer w0.254: v1(92.8,40.86) 92.8,41.57 102.05,50.82 112.55,50.82 U19.6
SDA: length 38.7
  Top Layer w0.254: v1(91.83,41.26) 91.83,41.22 91.58,40.96 86.59,40.96 86.58,40.97 U5.59
  Bottom Layer w0.254: U19.5 114.41,51.5 102.08,51.5 v1(91.83,41.26)
STEP1: length 66.3
  Top Layer w0.254: U7.7 17.64,28.77 v1(39.03,28.77) ; 75.06,39.99 68.52,39.99 v1(68.43,40.09)
  Bottom Layer w0.254: v1(68.43,40.09) 62.85,34.51 41.26,34.51 39.03,32.28 v1(39.03,28.77)
STEP2: length 36.9
  Top Layer w0.254: 77.56,33.99 77.56,31.85 76.29,30.57 69,30.57 66.97,28.54 45.99,28.54 U9.7
STEP3: length 14.5
  Top Layer w0.254: U11.7 74.56,26.03 78.78,26.03 79.59,26.84 79.59,28.09 80.06,28.55 80.06,33.99
STEP4: length 20.6
  Top Layer w0.254: v1(94.45,35.21) 91.66,37.99 86.56,37.99
  Bottom Layer w0.254: 101.88,27.28 101.88,28.66 98.13,32.4 97.25,32.4 v1(94.45,35.21)
SW1_IN: length 74.4
  Top Layer w0.254: v1(69,36.77) 73.64,36.77 73.87,36.99 75.06,36.99
  Bottom Layer w0.254: U1.2 32.67,3.24 63.16,3.24 63.89,3.98 63.89,7.94 67.6,11.65 67.6,35.37 v1(69,36.77)
SW1_OUT: length 78.5
  Top Layer w0.254: 75.06,37.49 69.72,37.49 v1(69.63,37.58)
  Bottom Layer w0.254: U1.3 30.83,2.58 63.59,2.58 64.48,3.47 64.48,7.69 68.37,11.58 68.37,35.02 69.63,36.29 v1(69.63,37.58)
SW2_IN: length 41.4
  Top Layer w0.254: v1(67.02,13.07) 67.02,25.65 70.6,29.23 77.2,29.23 79.06,31.09 79.06,33.99
  Bottom Layer w0.254: U2.2 67.02,11.92 v1(67.02,13.07)
SW2_OUT: length 42.9
  Top Layer w0.254: 78.56,33.99 78.56,31.3 76.92,29.66 70.07,29.66 66.05,25.65 v1(66.05,12.72)
  Bottom Layer w0.254: v1(66.05,12.72) 60.49,7.16 59.55,7.16 57.15,4.75 U2.3
SW3_IN: length 60.2
  Top Layer w0.254: v1(93.79,12.97) 93.79,28.34 92.27,29.86 82.44,29.86 81.56,30.74 81.56,33.99
  Bottom Layer w0.254: U3.2 86.73,3.47 79.57,3.47 79.01,4.03 79.01,4.71 83.77,9.47 90.29,9.47 v1(93.79,12.97)
SW3_OUT: length 59.5
  Top Layer w0.254: v1(93.05,14.85) 93.05,28.01 91.89,29.18 82.26,29.18 81.06,30.38 81.06,33.99 ; U3.3 83.92,3.17 79.92,3.17 79.06,4.03 79.06,4.82 83.6,9.37 v1(91.99,9.37)
  Bottom Layer w0.254: v1(91.99,9.37) 94.37,11.75 94.37,13.53 v1(93.05,14.85)
SW4_IN: length 60.9
  Top Layer w0.254: 86.55,37 90.18,37 v1(90.77,36.42)
  Bottom Layer w0.254: 116.21,4.55 118.58,6.92 118.58,24.83 117.69,25.72 116.98,25.72 115.89,26.82 115.89,28.59 106.21,38.27 93.49,38.27 91.63,36.42 v1(90.77,36.42)
SW4_OUT: length 69.3
  Top Layer w0.254: 86.55,40 91.31,40 v1(91.99,39.32)
  Bottom Layer w0.254: v1(91.99,39.32) 93.81,39.32 93.84,39.35 106.92,39.35 120.21,26.07 120.21,3.6 119.64,3.03 115.14,3.03 113.71,4.46 113.71,4.55
SWCLK: length 32.7
  Top Layer w0.254: P1.2 105.96,54.73 v1(104.59,53.36) ; 86.55,36 v1(88.48,36)
  Bottom Layer w0.254: v1(88.48,36) 88.48,39.92 101.92,53.36 v1(104.59,53.36)
SWDIO: length 40.5
  Top Layer w0.254: P1.3 108.46,55.17 v1(106.06,52.77) ; 83.56,33.99 83.56,35.66 84.06,36.16 84.9,36.16 85.66,35.4 v1(89.12,35.4)
  Bottom Layer w0.254: v1(106.06,52.77) 102.4,52.77 89.12,39.49 v1(89.12,35.4)
TX: length 51.3
  Top Layer w0.254: CN1.3 51.34,74.97 52.29,75.91 54.42,75.91 55,75.33 55,68.12 58.08,65.04 65.16,65.04 71.69,58.51 71.69,49.36 73.94,47.11 76.59,47.11 77.06,46.64 77.06,45.49
$1N1496: length 14.1
  Top Layer w0.254: C2.1 78.31,52.76 78.29,52.75 81.57,52.75 82.06,52.26 U5.6
$1N1502: length 15
  Top Layer w0.254: U5.5 82.56,52.21 83.1,52.75 X1.2 87.29,52.85 C1.1
$1N1990: length 11.6
  Top Layer w0.254: U6.2 56.5,40.2 56.5,40.18 56.68,40 58.41,40 59.3,39.11 59.3,37.56 58.51,36.77 56.53,36.77 55.64,35.89 R1.2
$1N1994: length 7.3
  Top Layer w0.254: R2.1 56.91,46.29 56.91,41.98 57.66,41.23 U6.5
$1N3361: length 2.5
  Top Layer w0.254: U7.5 U7.6
$1N3426: length 12
  Top Layer w0.254: U8.4 23.52,21.95 U7.2
$1N3430: length 12
  Top Layer w0.254: U7.3 21.99,22.95 17.53,22.95 U8.5
$1N3435: length 12.1
  Top Layer w0.254: U8.6 13.98,22.09 15.71,23.82 20.31,23.82 U7.4
$1N3971: length 2.5
  Top Layer w0.254: U9.5 U9.6
$1N3975: length 11.9
  Top Layer w0.254: U10.4 52.35,22.2 U9.2
$1N3977: length 12.1
  Top Layer w0.254: U10.5 45.1,22.56 46.51,23.97 51.58,23.97 U9.3
$1N3979: length 11.9
  Top Layer w0.254: U9.4 49.88,24.81 45.17,24.81 U10.6
$1N4314: length 2.5
  Top Layer w0.254: U11.6 U11.5
$1N4318: length 12
  Top Layer w0.254: U11.2 80.67,21.95 U12.4
$1N4320: length 12
  Top Layer w0.254: U11.3 79.64,23.46 75.19,23.46 U12.5
$1N4322: length 12
  Top Layer w0.254: U11.4 78.02,24.38 73.57,24.38 U12.6
$1N4657: length 2.5
  Top Layer w0.254: 106.96,27.28 104.42,27.28
$1N4661: length 12
  Top Layer w0.254: 114.58,27.28 109.24,21.95 104.8,21.95
$1N4663: length 12
  Top Layer w0.254: 112.04,27.28 108.04,23.28 103.59,23.28 102.26,21.95
$1N4665: length 12.4
  Top Layer w0.254: 109.5,27.28 106.41,24.2 101.18,24.2 99.72,22.73 99.72,21.95
$1N7887: length 10.9
  Top Layer w0.254: v1(74.72,72.89) 75.66,72.89 76.33,72.21 R7.1 ; U17.B5 69.56,74.24 v1(68.87,73.55)
  Bottom Layer w0.254: v1(68.87,73.55) 69.53,72.89 v1(74.72,72.89)
$1N7903: length 4.4
  Top Layer w0.254: U17.A5 72.56,73.93 73.8,72.68 R8.1
$1N7921: length 14.7
  Top Layer w0.254: U17.B6 70.56,73.89 68.95,72.28 67.93,72.28 67.68,72.03 67.68,70.33 67.86,70.15 69.36,70.15 70.39,71.18 R9.1 71.27,72.6 71.56,72.89 U17.A6
$1N7927: length 8.1
  Top Layer w0.254: R10.1 71.06,73.5 U17.A7 71.06,76.12 71.29,76.35 71.79,76.35 72.06,76.08 U17.B7
$1N8511: length 3.2
  Top Layer w0.254: LED2.2 68.24,57.13 67.83,57.13
$1N9497: length 35.2
  Top Layer w1.2: D2.1 16.47,32.33 14.73,34.07 14.73,39.83 12.35,42.22 12.35,51.68 12.96,52.29 15.1,52.29
$1N12294: length 2.4
  Top Layer w0.254: R14.1 93.94,57.74 LED3.2
$1N24174: length 19.2
  Top Layer w0.8: D5.2 99.2,53.61 101.38,51.43 109.28,51.43 110.96,53.1 P1.4

## Copper pours and planes (outline as drawn; the poured copper is in the pictures)
3V3 on Top Layer: 54.73,60.85 68.52,60.85 68.52,51.43 54.73,51.43
5V on Top Layer: 13.48,49.4 26.12,49.4 26.12,33.85 13.48,33.85
5V on Top Layer: 50.53,60.17 55.11,60.17 55.11,56.85 50.53,56.85
5V on Top Layer: 25.87,39.82 33.77,39.82 33.77,35.12 25.87,35.12
12V on Top Layer: 9.32,64.98 25.56,64.98 25.56,53.44 9.32,53.44
12V_IN on Top Layer: 11.69,70.09 38.9,70.09 38.9,59.88 11.69,59.88
GND on Top Layer: 13.48,51.22 21.63,51.22 21.63,49.93 13.48,49.93
GND on Top Layer: 13.48,47.87 18.1,47.87 18.1,44.44 13.48,44.44
GND on Top Layer: 17.41,61.69 29.37,61.69 29.37,51.76 17.41,51.76
GND on Top Layer: -3.16,87.07 136.07,87.07 136.07,-5.02 -3.16,-5.02
GND on Top Layer: 58.66,60.88 63.46,60.88 63.46,56.58 58.66,56.58
GND on Top Layer: 25.41,56.2 33.76,56.2 33.76,40.43 25.41,40.43
GND on Bottom Layer: 8.69,81.09 37.39,81.09 37.39,67.09 8.69,67.09
GND on Bottom Layer: -9.04,87.93 142.31,87.93 142.31,-6.73 -9.04,-6.73
(no net) on Top Layer: 7,10.67 6.96,11 6.88,11.33 6.77,11.65 6.63,11.95 6.45,12.24 6.24,12.5 6,12.74 5.74,12.95 5.45,13.13 5.15,13.27 4.83,13.38 4.5,13.46 4.17,13.5 3.83,13.5 3.5,13.46 3.17,13.38 2.85,13.27 2.55,13.13 2.26,12.95 2,12.74 1.76,12.5 1.55,12.24 1.37,11.95 1.23,11.65 1.12,11.33 1.04,11 1,10.67 1,10.33 1.04,10 1.12,9.67 1.23,9.35 1.37,9.05 1.55,8.76 1.76,8.5 2,8.26 2.26,8.05 2.55,7.87 2.85,7.73 3.17,7.62 3.5,7.54 3.83,7.5 4.17,7.5 4.5,7.54 4.83,7.62 5.15,7.73 5.45,7.87 5.74,8.05 6,8.26 6.24,8.5 6.45,8.76 6.63,9.05 6.77,9.35 6.88,9.67 6.96,10 7,10.33
(no net) on Top Layer: 7,50.67 6.96,51 6.88,51.33 6.77,51.65 6.63,51.95 6.45,52.24 6.24,52.5 6,52.74 5.74,52.95 5.45,53.13 5.15,53.27 4.83,53.38 4.5,53.46 4.17,53.5 3.83,53.5 3.5,53.46 3.17,53.38 2.85,53.27 2.55,53.13 2.26,52.95 2,52.74 1.76,52.5 1.55,52.24 1.37,51.95 1.23,51.65 1.12,51.33 1.04,51 1,50.67 1,50.33 1.04,50 1.12,49.67 1.23,49.35 1.37,49.05 1.55,48.76 1.76,48.5 2,48.26 2.26,48.05 2.55,47.87 2.85,47.73 3.17,47.62 3.5,47.54 3.83,47.5 4.17,47.5 4.5,47.54 4.83,47.62 5.15,47.73 5.45,47.87 5.74,48.05 6,48.26 6.24,48.5 6.45,48.76 6.63,49.05 6.77,49.35 6.88,49.67 6.96,50 7,50.33
(no net) on Top Layer: 129.9,10.67 129.86,11 129.78,11.33 129.67,11.65 129.53,11.95 129.35,12.24 129.14,12.5 128.9,12.74 128.64,12.95 128.35,13.13 128.05,13.27 127.73,13.38 127.4,13.46 127.07,13.5 126.73,13.5 126.4,13.46 126.07,13.38 125.75,13.27 125.45,13.13 125.16,12.95 124.9,12.74 124.66,12.5 124.45,12.24 124.27,11.95 124.13,11.65 124.02,11.33 123.94,11 123.9,10.67 123.9,10.33 123.94,10 124.02,9.67 124.13,9.35 124.27,9.05 124.45,8.76 124.66,8.5 124.9,8.26 125.16,8.05 125.45,7.87 125.75,7.73 126.07,7.62 126.4,7.54 126.73,7.5 127.07,7.5 127.4,7.54 127.73,7.62 128.05,7.73 128.35,7.87 128.64,8.05 128.9,8.26 129.14,8.5 129.35,8.76 129.53,9.05 129.67,9.35 129.78,9.67 129.86,10 129.9,10.33
(no net) on Top Layer: 129.9,50.17 129.86,50.5 129.78,50.83 129.67,51.15 129.53,51.45 129.35,51.74 129.14,52 128.9,52.24 128.64,52.45 128.35,52.63 128.05,52.77 127.73,52.88 127.4,52.96 127.07,53 126.73,53 126.4,52.96 126.07,52.88 125.75,52.77 125.45,52.63 125.16,52.45 124.9,52.24 124.66,52 124.45,51.74 124.27,51.45 124.13,51.15 124.02,50.83 123.94,50.5 123.9,50.17 123.9,49.83 123.94,49.5 124.02,49.17 124.13,48.85 124.27,48.55 124.45,48.26 124.66,48 124.9,47.76 125.16,47.55 125.45,47.37 125.75,47.23 126.07,47.12 126.4,47.04 126.73,47 127.07,47 127.4,47.04 127.73,47.12 128.05,47.23 128.35,47.37 128.64,47.55 128.9,47.76 129.14,48 129.35,48.26 129.53,48.55 129.67,48.85 129.78,49.17 129.86,49.5 129.9,49.83
$1N9497 on Top Layer: 11.75,43.5 18.1,43.5 18.1,33.8 11.75,33.8
$1N23968 on Top Layer: 22.32,64.89 32.33,64.89 32.33,57.01 22.32,57.01

## Text on the board
Bottom Silkscreen Layer: BT3 | BT2 | BT1 | SDA | SCL | 3V3 | GND | B2 | B1 | A2 | A1 | DC+ | DC- | OUT | IN
Top Silkscreen Layer: 0 | 1 | BOOT0 | BOOT1 | 5V | TX | RX | GND | SCLK | SDIO | 3V3 | DIR | MS3 | MS2 | MS1 | EN | by KhoMon3D | v1.0 | MFU
